# Altium schematic sheet connector.SchDoc
size Letter; SheetNumber: 4; SheetTotal: 4
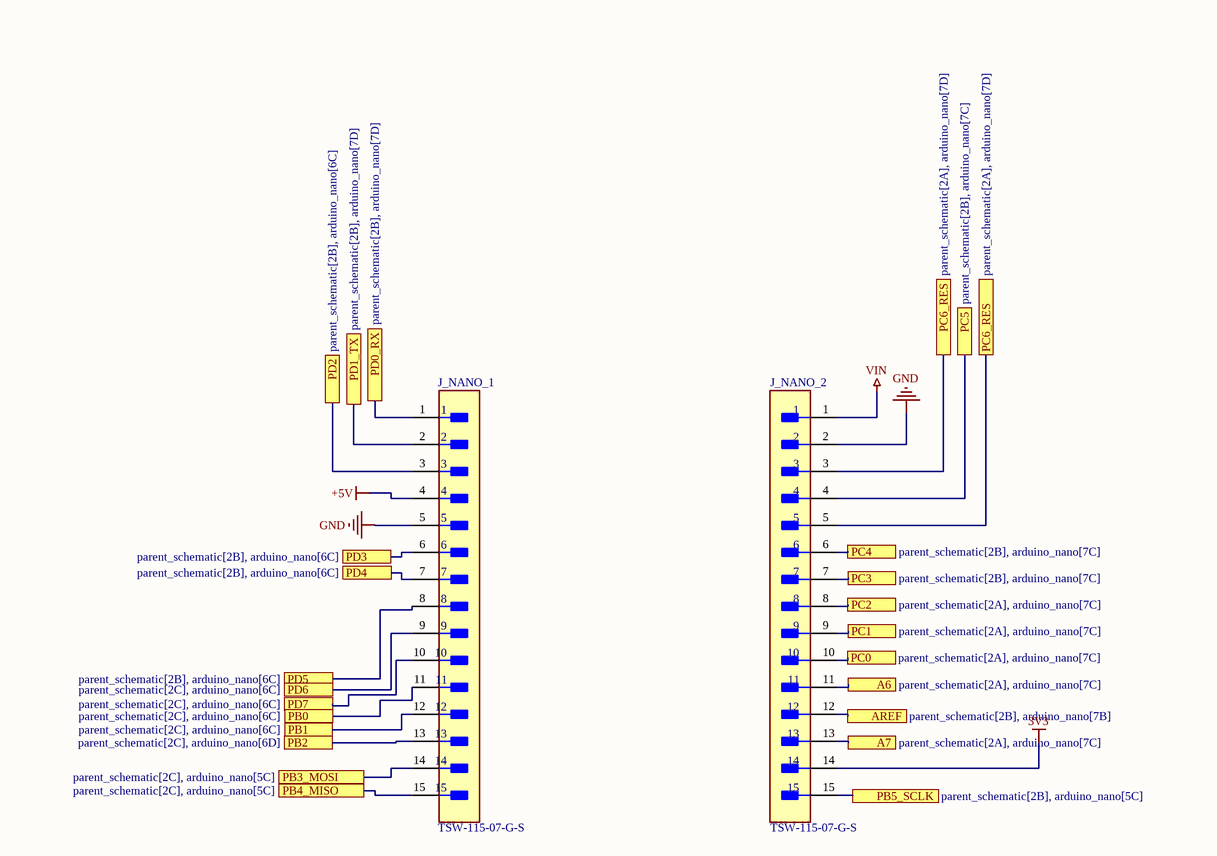
[diagram p0: connector.SchDoc]

## Parts
J_NANO_1  TSW-115-07-G-S  [FP-TSW-115-07-G-S-MFG]
J_NANO_2  TSW-115-07-G-S  [FP-TSW-115-07-G-S-MFG]

## Ports
A6 (see parent_schematic[2A], arduino_nano[7C]), A7 (see parent_schematic[2A], arduino_nano[7C]), AREF (see parent_schematic[2B], arduino_nano[7B]), PB0 (see parent_schematic[2C], arduino_nano[6C]), PB1 (see parent_schematic[2C], arduino_nano[6C]), PB2 (see parent_schematic[2C], arduino_nano[6D]), PB3_MOSI (see parent_schematic[2C], arduino_nano[5C]), PB4_MISO (see parent_schematic[2C], arduino_nano[5C]), PB5_SCLK (see parent_schematic[2B], arduino_nano[5C]), PC0 (see parent_schematic[2A], arduino_nano[7C]), PC1 (see parent_schematic[2A], arduino_nano[7C]), PC2 (see parent_schematic[2A], arduino_nano[7C]), PC3 (see parent_schematic[2B], arduino_nano[7C]), PC4 (see parent_schematic[2B], arduino_nano[7C]), PC5 (see parent_schematic[2B], arduino_nano[7C]), PC6_RES (see parent_schematic[2A], arduino_nano[7D]), PD0_RX (see parent_schematic[2B], arduino_nano[7D]), PD1_TX (see parent_schematic[2B], arduino_nano[7D]), PD2 (see parent_schematic[2B], arduino_nano[6C]), PD3 (see parent_schematic[2B], arduino_nano[6C]), PD4 (see parent_schematic[2B], arduino_nano[6C]), PD5 (see parent_schematic[2B], arduino_nano[6C]), PD6 (see parent_schematic[2C], arduino_nano[6C]), PD7 (see parent_schematic[2C], arduino_nano[6C])

## Nets
3V3: J_NANO_2.14
+5V: J_NANO_1.4
GND: J_NANO_1.5 J_NANO_2.2
VIN: J_NANO_2.1
A6: J_NANO_2.11 ; port A6
A7: J_NANO_2.13 ; port A7
AREF: J_NANO_2.12 ; port AREF
PB0: J_NANO_1.11 ; port PB0
PB1: J_NANO_1.12 ; port PB1
PB2: J_NANO_1.13 ; port PB2
PB3_MOSI: J_NANO_1.14 ; port PB3_MOSI
PB4_MISO: J_NANO_1.15 ; port PB4_MISO
PB5_SCLK: J_NANO_2.15 ; port PB5_SCLK
PC0: J_NANO_2.10 ; port PC0
PC1: J_NANO_2.9 ; port PC1
PC2: J_NANO_2.8 ; port PC2
PC3: J_NANO_2.7 ; port PC3
PC4: J_NANO_2.6 ; port PC4
PC5: J_NANO_2.4 ; port PC5
PC6_RES: J_NANO_2.3 J_NANO_2.5 ; port PC6_RES
PD0_RX: J_NANO_1.1 ; port PD0_RX
PD1_TX: J_NANO_1.2 ; port PD1_TX
PD2: J_NANO_1.3 ; port PD2
PD3: J_NANO_1.6 ; port PD3
PD4: J_NANO_1.7 ; port PD4
PD5: J_NANO_1.8 ; port PD5
PD6: J_NANO_1.9 ; port PD6
PD7: J_NANO_1.10 ; port PD7

## Library data of the parts
J_NANO_1 J_NANO_2 = CMP-02766-000090-1: CONN HEADER VERT 15POS 2.54MM; Manufacturer: SAMTEC; Conn Gender: Male; Number Of Contacts: 15; Conn Orientation: Vertical; Package: TSW-115-07-G-S; RoHS: TRUE; Manufacturer Part Number: TSW-115-07-G-S; Digikey Description: CONN HEADER VERT 15POS 2.54MM; Device Class L1: Connectors; Temperature Range Low: -55°C; Height: 8.71mm; Contact Material: Gold,Nickel; ComponentLink2URL: http://suddendocs.samtec.com/catalog_english/tsw_th.pdf; ComponentLink2Description: Datasheet; Category: Conn; Footprint Url: http://suddendocs.samtec.com/prints/tsw-xxx-xx-x-x-xx-xxx-footprint.pdf; Lead Free: Yes; Octopart: https://octopart.com/tsw-115-07-g-s-samtec-272210; Pitch: 2.54mm; Device Class L2: Headers and Wire Housings; Temperature: -55°C to +125°C; Number Of Rows: 1; Automotive: No; Device Class L3: unset; Temperature Range High: +125°C